# EAGLE design scentclock_1 (EAGLE 5.07)
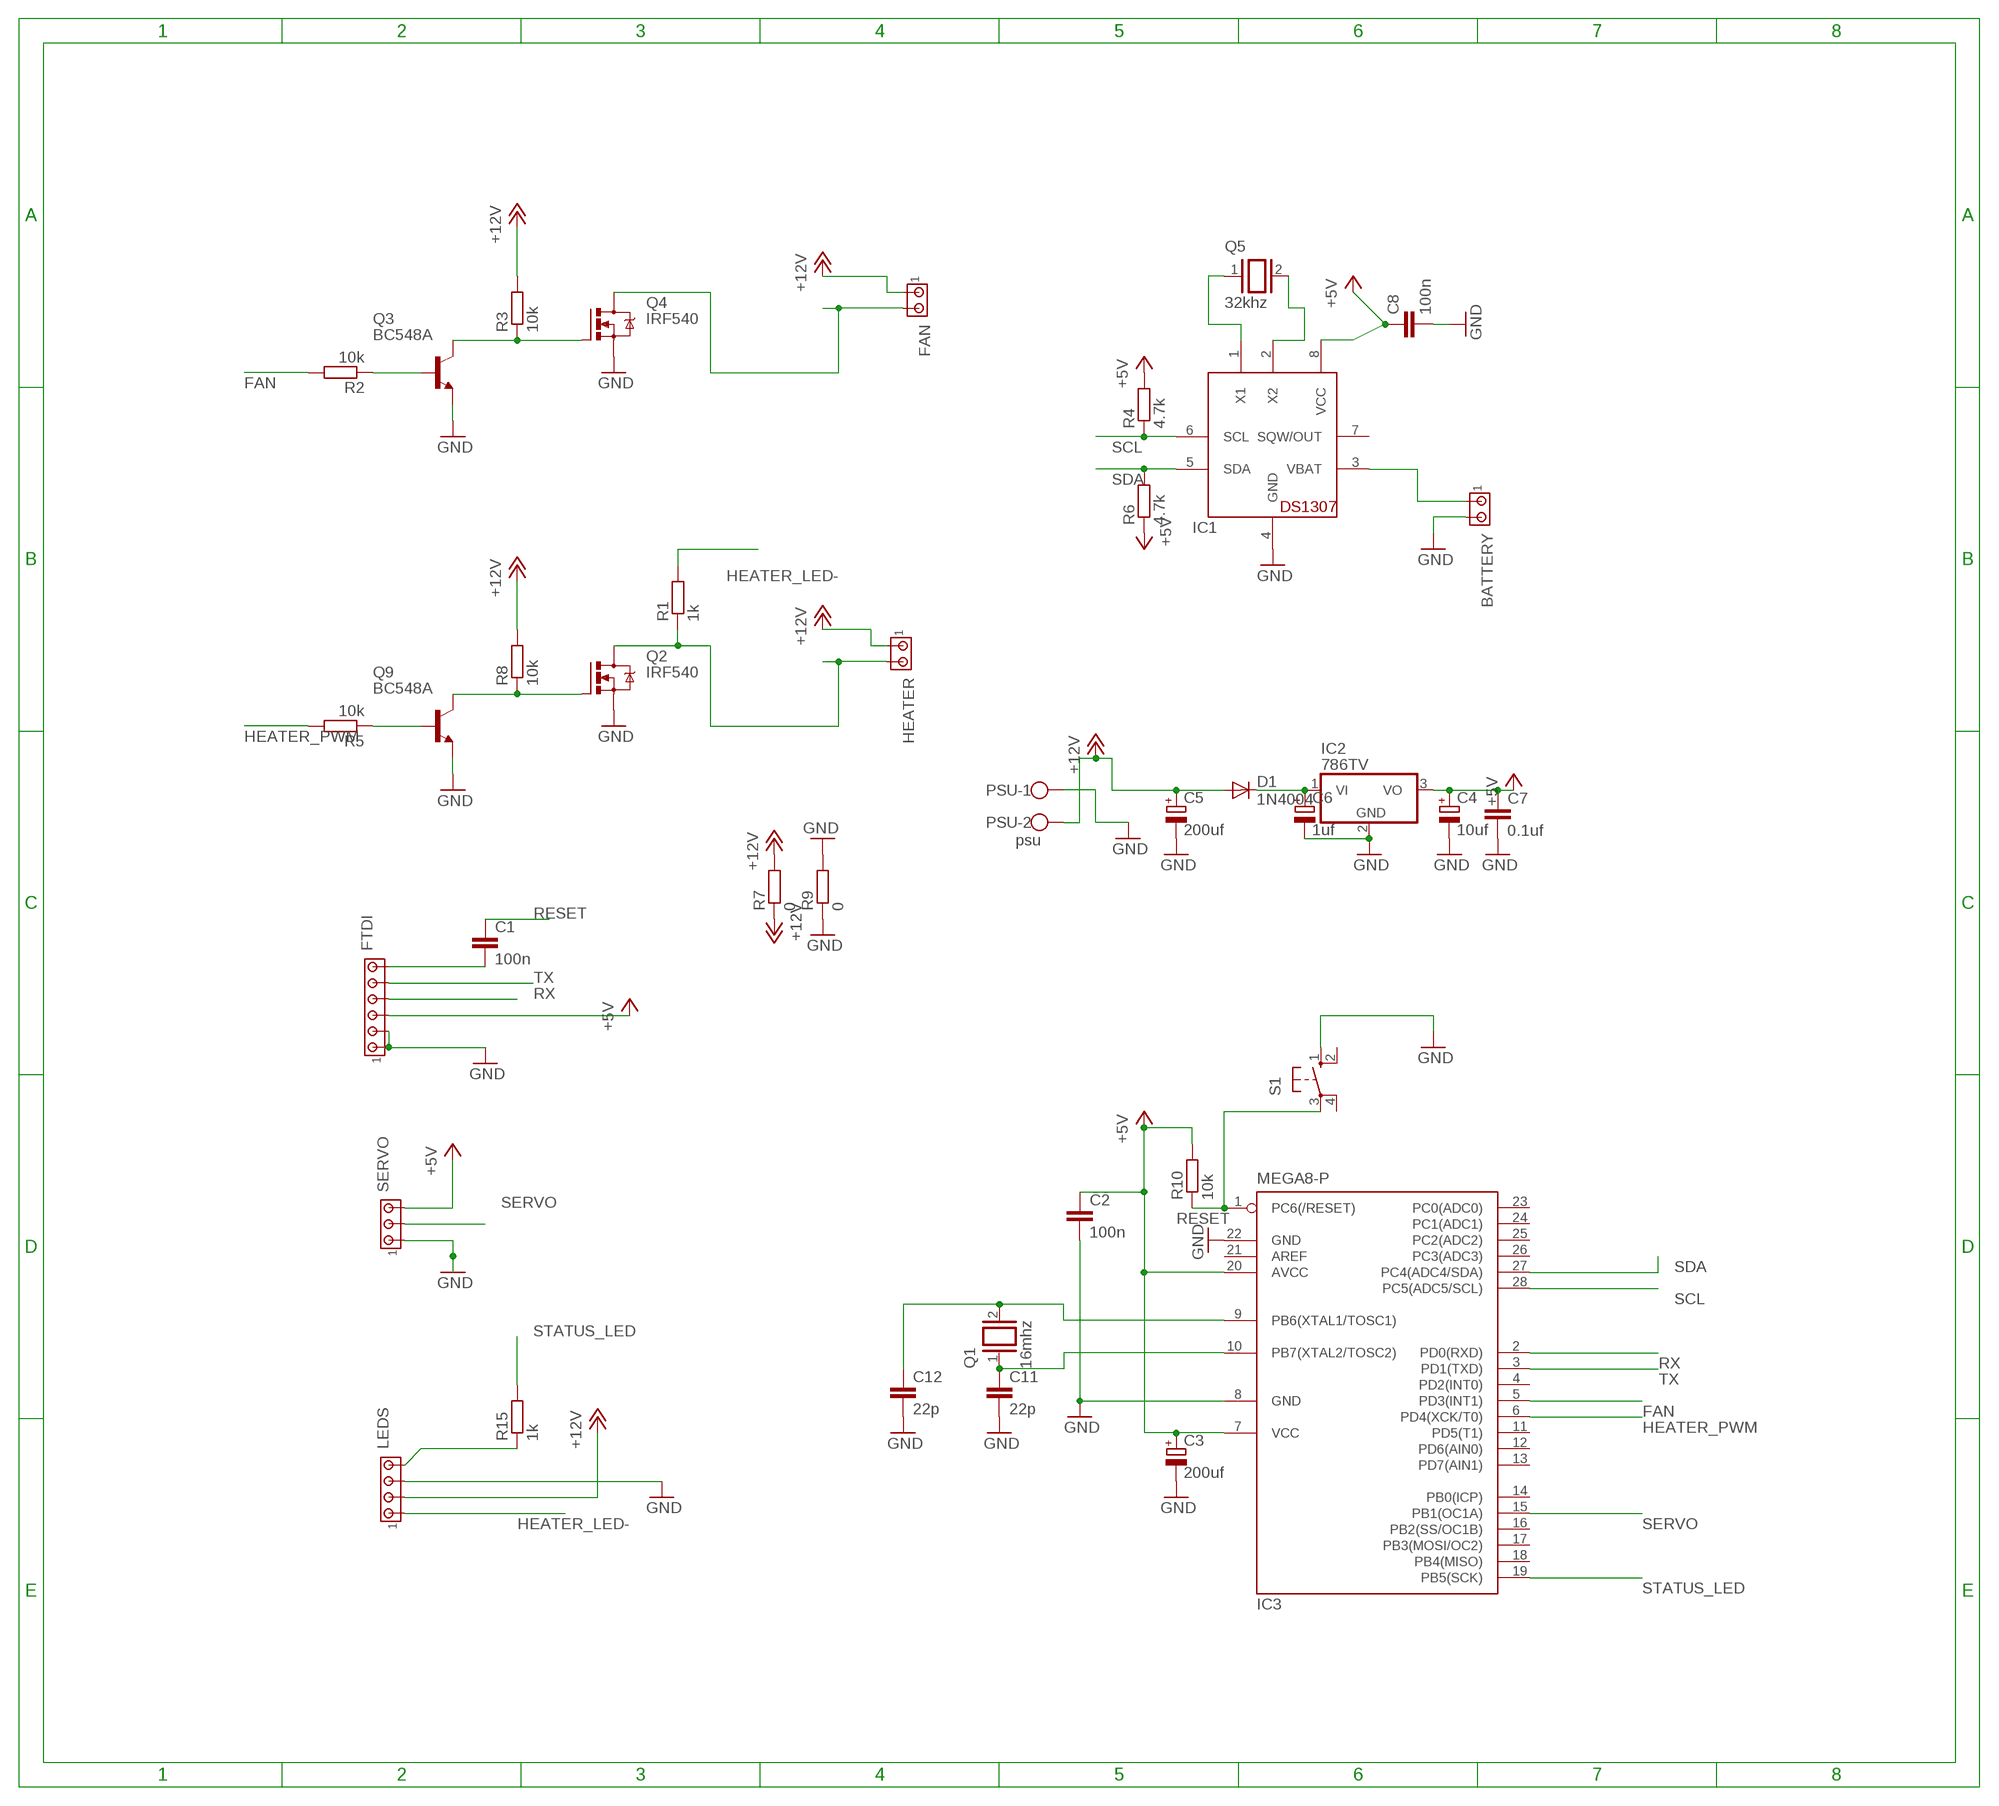
[diagram p0: schematic, sheet 1]

## Parts
BATTERY  MTA02-100  [10X02MTA]
C1  100n  C-EU050-025X075  [C050-025X075]
C2  100n  C-EU050-025X075  [C050-025X075]
C3  200uf  CPOL-EUE2-4  [E2-4]
C4  10uf  CPOL-EUE2-4  [E2-4]
C5  200uf  CPOL-EUE3.5-8  [E3,5-8]
C6  1uf  CPOL-EUE2-4  [E2-4]
C7  0.1uf  C-EU050-025X075  [C050-025X075]
C8  100n  C-EU050-025X075  [C050-025X075]
C11  22p  C-EU050-025X075  [C050-025X075]
C12  22p  C-EU050-025X075  [C050-025X075]
D1  1N4004  [DO41-10]
FAN  MTA02-100  [10X02MTA]
FTDI  MTA06-100  [10X06MTA]
HEATER  MTA02-100  [10X02MTA]
IC1  DS1307  [DIL08]
IC2  786TV  [TO220V]
IC3  MEGA8-P  [DIL28-3]
LEDS  MTA04-100  [10X04MTA]
PSU  psu  W237-102  [W237-102]
Q1  16mhz  XTAL/S  [QS]
Q2  IRF540  [TO220BV]
Q3  BC548A  [TO92-EBC]
Q4  IRF540  [TO220BV]
Q5  32khz  XTAL/S  [QS]
Q9  BC548A  [TO92-EBC]
R1  1k  R-EU_0204/7  [0204/7]
R2  10k  R-EU_0204/7  [0204/7]
R3  10k  R-EU_0204/7  [0204/7]
R4  4.7k  R-EU_0204/7  [0204/7]
R5  10k  R-EU_0204/7  [0204/7]
R6  4.7k  R-EU_0204/7  [0204/7]
R7  0  R-EU_0204/7  [0204/7]
R8  10k  R-EU_0204/7  [0204/7]
R9  0  R-EU_0204/7  [0204/7]
R10  10k  R-EU_0204/7  [0204/7]
R15  1k  R-EU_0204/7  [0204/7]
S1  10-XX  [B3F-10XX]
SERVO  MTA03-100  [10X03MTA]

## Nets
+5V: C2.1 C3.+ C4.+ C7.1 C8.1 FTDI.4 IC1.8(VCC) IC2.3(VO) IC3.7(VCC) IC3.20(AVCC) R4.2 R6.1 R10.2 SERVO.3
+12V [power]: C5.+ D1.A FAN.1 HEATER.1 LEDS.2 PSU.2 R3.2 R7.1 R7.2 R8.2
FAN: IC3.5(PD3(INT1)) R2.2
GND [power]: BATTERY.2 C2.2 C3.- C4.- C5.- C6.- C7.2 C8.2 C11.2 C12.2 FTDI.5 FTDI.6 IC1.4(GND) IC2.2(GND) IC3.8(GND) IC3.22(GND) LEDS.3 PSU.1 Q2.S Q3.E Q4.S Q9.E R9.1 R9.2 S1.1(S) SERVO.1
HEATER_LED-: LEDS.1 R1.2
HEATER_PWM: IC3.6(PD4(XCK/T0)) R5.2
N$1: Q3.C Q4.G R3.1
N$3: IC1.1(X1) Q5.1
N$4 [power]: HEATER.2 Q2.D R1.1
N$5: C1.2 FTDI.1
N$6: Q3.B R2.1
N$7: LEDS.4 R15.1
N$8 [power]: FAN.2 Q4.D
N$9: IC1.2(X2) Q5.2
N$10: C11.1 IC3.10(PB7(XTAL2/TOSC2)) Q1.1
N$11: C12.1 IC3.9(PB6(XTAL1/TOSC1)) Q1.2
N$12: BATTERY.1 IC1.3(VBAT)
N$17: Q2.G Q9.C R8.1
N$18: Q9.B R5.1
N$19: C6.+ D1.C IC2.1(VI)
RESET: C1.1 IC3.1(PC6(/RESET)) R10.1 S1.3(P)
RX: FTDI.3 IC3.2(PD0(RXD))
SCL: IC1.6(SCL) IC3.28(PC5(ADC5/SCL)) R4.1
SDA: IC1.5(SDA) IC3.27(PC4(ADC4/SDA)) R6.2
SERVO: IC3.15(PB1(OC1A)) SERVO.2
STATUS_LED: IC3.19(PB5(SCK)) R15.2
TX: FTDI.2 IC3.3(PD1(TXD))
Unconnected: IC1.7(SQW/OUT) IC3.4(PD2(INT0)) IC3.11(PD5(T1)) IC3.12(PD6(AIN0)) IC3.13(PD7(AIN1)) IC3.14(PB0(ICP)) IC3.16(PB2(SS/OC1B)) IC3.17(PB3(MOSI/OC2)) IC3.18(PB4(MISO)) IC3.21(AREF) IC3.23(PC0(ADC0)) IC3.24(PC1(ADC1)) IC3.25(PC2(ADC2)) IC3.26(PC3(ADC3)) S1.2(S1) S1.4(P1)

## Library data of the parts
BATTERY FAN HEATER = matt con-amp:MTA02-100: AMP connector
C1 C2 C7 C8 C11 C12 = matt rcl:C-EU: CAPACITOR, European symbol
C3-C6 = matt rcl:CPOL-EU: POLARIZED CAPACITOR, European symbol
D1 = matt diode:1N4004: DIODE general purpose rectifier, 1 A
FTDI = matt con-amp:MTA06-100: AMP connector
IC1 = adafruit:DS1307: DS1307 Real time clock (RTC) with battery backup ability. Talk to it via i2c
IC2 = linear:78*: Positive VOLTAGE REGULATOR Source: http://cache.national.com/ds/LM/LM78L05.pdf http://www.fairchildsemi.com/ds/LM/LM7805.pdf
IC3 = atmel:MEGA8-P: MICROCONTROLLER 8 Kbytes FLASH, 1 kbytes SRAM, 512 bytes EEPROM, USART, 4-channel 10 bit ADC, 2-channel 8 bit ADC Pin compatible with Atmega48, ATMega88, ATMega168 Source: avr.lbr
LEDS = matt con-amp:MTA04-100: AMP connector
PSU = matt con-wago-500:W237-102: WAGO SCREW CLAMP
Q1 Q5 = matt special:XTAL/S: CRYSTAL
Q2 Q4 = transistor-power:IRF540: HEXFET Power MOSFET
Q3 Q9 = matt transistor-npn:BC548*: NPN Transistor
R1-R10 R15 = matt rcl:R-EU_: RESISTOR, European symbol
S1 = switch-omron:10-XX: OMRON SWITCH
SERVO = matt con-amp:MTA03-100: AMP connector

## Net classes
1 power: width 2 mm

## Board
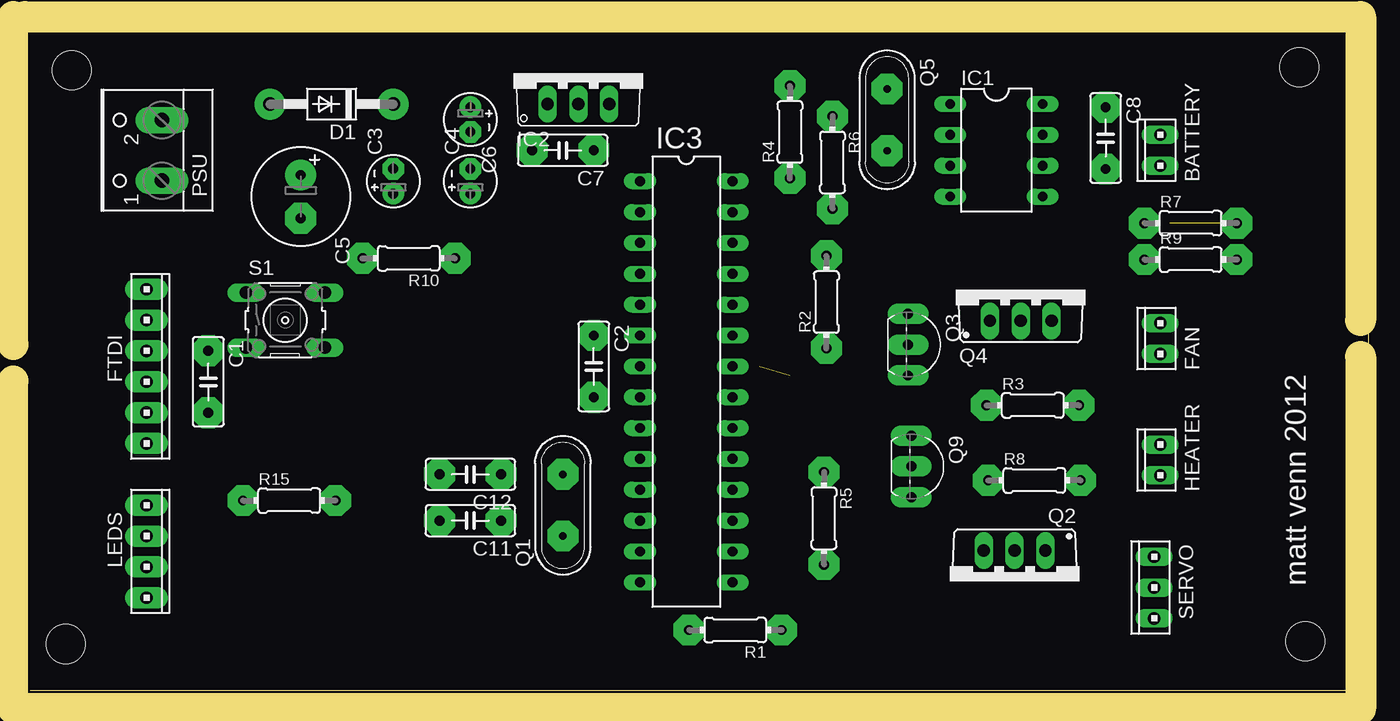
[diagram p1: board, top side]
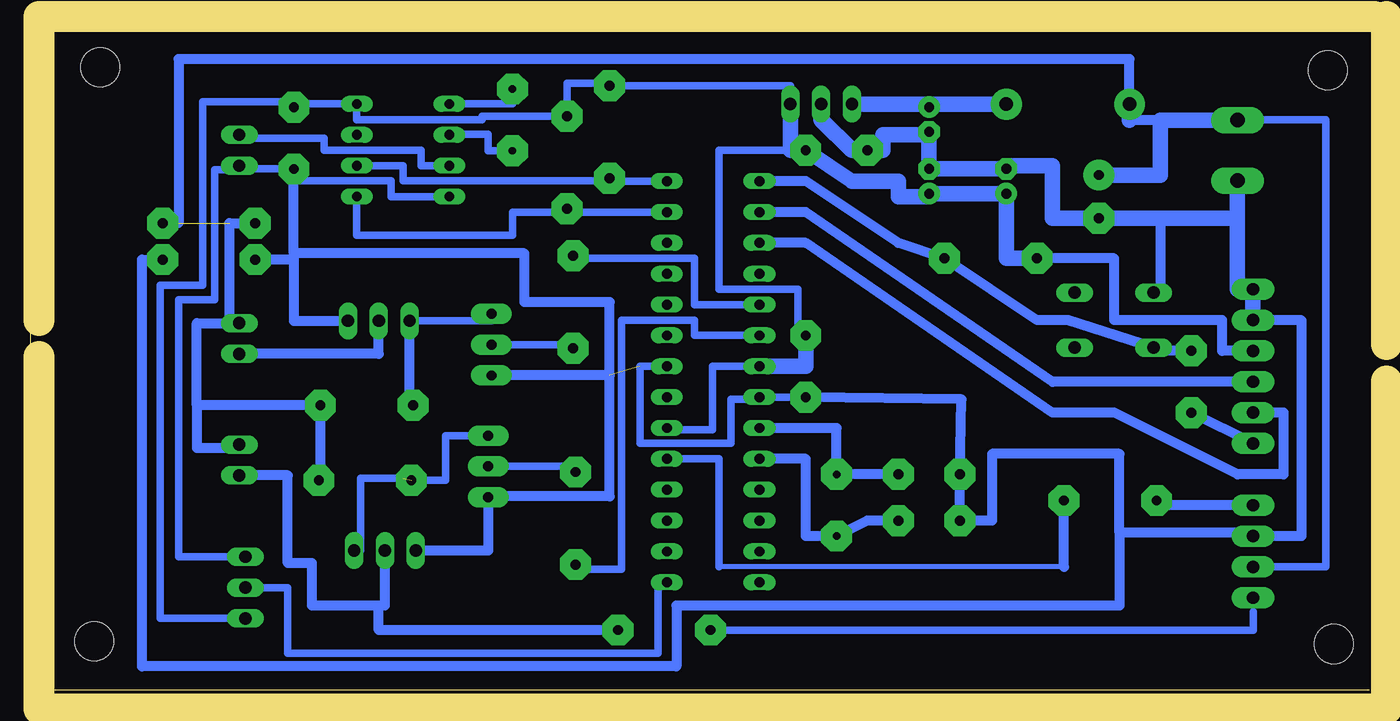
[diagram p2: board, bottom side, seen from below]

Size 110.26 x 54.33 mm. Coordinates in mm from the lower left corner, seen from the top.
Outline: 0,0 110.16,0 110.26,54.33 0.1,54.33
Copper layers (1*16): Top 0.035mm / dielectric 1.5mm / Bottom 0.035mm
Design rules "default": minimum track width 10mil, minimum drill 24mil, track to track 8mil, track to pad 8mil, pad to pad 8mil, via to via 8mil, smd to smd 8mil, copper to edge 40mil, drill to drill 8mil, minimum pad ring 10mil, minimum via ring 8mil, stop-mask expansion 4mil, vias tented up to drill 0mil, thermal gap 10mil
Holes 3.2 mm at 2.91,3.81 104.51,51.31 105.01,4.03 3.41,51.03
Milling: 6 lines

### Footprints (pad centres in the part's own frame; a part is rotated, then mirrored left to right if it is on the bottom)
10X02MTA = drill 1.016 long: 1 1.27,0; 2 -1.27,0
C050-025X075 = drill 0.813 pad 2.54 octagon: 1 -2.54,0; 2 2.54,0
E2-4 = drill 0.813 pad 1.778 round: + -1.016,0 | drill 0.813 pad 1.778 octagon: - 1.016,0
E3,5-8 = drill 0.813 pad 2.54 round: + -1.778,0 | drill 0.813 pad 2.54 octagon: - 1.778,0
DO41-10 = drill 1.118 pad 2.54 round: A 5.08,0; C -5.08,0
10X06MTA = drill 1.016 pad 1.778 long: 1 6.35,0; 2 3.81,0; 3 1.27,0; 4 -1.27,0; 5 -3.81,0; 6 -6.35,0
DIL08 = drill 0.813 long: 1 -3.81,-3.81; 2 -1.27,-3.81; 3 1.27,-3.81; 4 3.81,-3.81; 5 3.81,3.81; 6 1.27,3.81; 7 -1.27,3.81; 8 -3.81,3.81
TO220V = drill 1.016 long: 1 -2.54,-2.54; 2 0,-2.54; 3 2.54,-2.54
DIL28-3 = drill 0.813 long: 1 -16.51,-3.81; 2 -13.97,-3.81; 3 -11.43,-3.81; 4 -8.89,-3.81; 5 -6.35,-3.81; 6 -3.81,-3.81; 7 -1.27,-3.81; 8 1.27,-3.81; 9 3.81,-3.81; 10 6.35,-3.81; 11 8.89,-3.81; 12 11.43,-3.81; 13 13.97,-3.81; 14 16.51,-3.81; 15 16.51,3.81; 16 13.97,3.81; 17 11.43,3.81; 18 8.89,3.81; 19 6.35,3.81; 20 3.81,3.81; 21 1.27,3.81; 22 -1.27,3.81; 23 -3.81,3.81; 24 -6.35,3.81; 25 -8.89,3.81; 26 -11.43,3.81; 27 -13.97,3.81; 28 -16.51,3.81
10X04MTA = drill 1.016 pad 1.778 long: 1 3.81,0; 2 1.27,0; 3 -1.27,0; 4 -3.81,0
W237-102 = drill 1.194 pad 2.184 long: 1 -2.5,-1.27; 2 2.5,-1.27
QS = drill 0.61 pad 2.54 octagon: 1 -2.54,0; 2 2.54,0
TO220BV = drill 1.016 long: D 0,-2.54; G -2.54,-2.54; S 2.54,-2.54
TO92-EBC = drill 0.813 pad 1.676 long: B 0,-1.27; C -2.54,-1.27; E 2.54,-1.27
0204/7 = drill 0.813 pad 2.54 octagon: 1 -3.81,0; 2 3.81,0
B3F-10XX = drill 1.016 long: 1 -3.251,2.261; 2 3.251,2.261; 3 -3.251,-2.261; 4 3.251,-2.261
10X03MTA = drill 1.016 long: 1 2.54,0; 2 0,0; 3 -2.54,0

### Placement (x,y rotation side)
BATTERY  93.06,44.46 90 top
C1  14.65,25.4 270 top
C2  46.4,26.67 270 top
C3  29.89,41.91 90 top
C4  36.24,41.91 90 top
C5  22.27,40.64 270 top
C6  36.24,46.99 270 top
C7  43.86,44.45 180 top
C8  88.56,45.46 270 top
C11  36.24,13.97 180 top
C12  36.24,17.78 180 top
D1  24.81,48.26 180 top
FAN  93.06,28.96 90 top
FTDI  9.57,26.67 270 top
HEATER  93.06,18.96 90 top
IC1  79.56,44.46 270 top
IC2  45.13,50.8 0 top
IC3  54.02,25.4 270 top
LEDS  9.57,11.43 270 top
PSU  9.57,44.45 90 top
Q1  43.86,15.24 90 top
Q2  81.06,8.96 180 top
Q3  73.56,28.46 270 top
Q4  81.56,32.96 0 top
Q5  70.56,46.96 270 top
Q9  73.82,18.43 270 top
R1  58.06,4.96 180 top
R2  65.56,31.96 90 top
R3  82.56,23.46 0 top
R4  62.56,45.96 90 top
R5  65.36,14.16 270 top
R6  66.06,43.46 270 top
R7  95.56,38.46 0 top
R8  82.69,17.28 0 top
R9  95.56,35.46 0 top
R10  31.16,35.56 180 top
R15  21.32,15.62 0 top
S1  21,30.48 0 top
SERVO  92.56,8.46 90 top

### Tracks (layer width: path | path; a pad name or v marks a point on that pad's centre or on a via)
+5V
  Bottom 0.406: C4.+ 36.24,40.64 | R4.2 62.56,49.96 | 73.06,47.27 73.06,46.96 | 88.56,48.27 C8.1 88.56,48.46 | 47.06,29.21 C2.1 | C7.1 | IC2.3 47.67,49.77 | 58.56,21.46 57.83,21.46 IC3.20
  Bottom 0.61: 62.56,49.96 66.06,49.96 R6.1 73.06,47.27 | 73.06,46.96 83.37,46.96 IC1.8 88.56,48.27 | SERVO.3 99.56,5.92 99.56,33.36 96.06,33.36 96.06,48.46 88.56,48.46 | 47.06,29.21 47.06,33.02 53.56,33.02 53.56,44.46 C7.1 | 47.67,49.77 R4.2 | IC3.7 54.06,26.67 54.06,21.46 57.83,21.46
  Bottom 0.813: R10.2 21,35.56 21,30.48 12.11,30.48 12.11,27.94 FTDI.4
  Bottom 1.27: IC3.7 46.4,26.67 C2.1 | C4.+ C3.+ 29.89,35.56 R10.2 | IC2.3 47.67,44.45 C7.1 42.59,41.91 38.78,41.91 38.78,40.64 36.24,40.64
+12V  (1 unrouted)
  Bottom 0.406: 93.06,19.96 HEATER.1 | R8.2 86.37,17.28 | 11.56,46.96 11.56,46.95 | FAN.1 93.86,30.23
  Bottom 0.61: LEDS.2 3.56,10.16 3.56,46.96 11.56,46.96
  Bottom 0.813: FAN.1 96.56,30.23 96.56,23.46 | 96.56,23.46 96.56,19.96 93.06,19.96 | 86.37,17.28 R3.2 96.56,23.46 | 17.19,46.95 19.73,46.95 | R7.1 93.86,38.46 93.86,33.16 93.86,30.23 | R7.2 98.06,38.46 98.06,51.96 19.73,51.96 D1.A
  Bottom 1.27: PSU.2 11.56,46.95 17.19,46.95 17.19,42.42 C5.+ | 19.73,46.95 D1.A
FAN
  Bottom 0.406: 65.56,35.56 R2.2
  Bottom 0.61: IC3.5 55.56,31.75 55.56,35.56 65.56,35.56
GND  (1 unrouted)
  Bottom 0.406: 29.89,43.18 C3.- | C6.- 36.24,45.72 | 17.19,32.74 S1.1 | C8.2 88.56,41.96 | 93.06,42.86 BATTERY.2 93.06,42.92 | 88.56,35.96 88.56,35.46 | 72.55,15.96 Q9.E | 9.57,30.46 FTDI.5 | LEDS.3 9.57,12.96 | IC3.8 50.21,23.96
  Bottom 0.61: C2.2 IC3.8 | IC1.4 80.56,40.65 80.56,41.96 88.56,41.96 | SERVO.1 98.06,11 98.06,32.16 95.06,32.16 95.06,42.86 93.06,42.86 | C8.2 93.06,42.92 | IC3.22 60.06,26.67 60.06,20.32 52.56,20.32 52.56,23.96 50.21,23.96
  Bottom 0.813: C2.2 33.56,23.96 C12.2 C11.2 31.06,13.97 31.06,19.46 20.56,19.46 20.56,12.96 | 17.19,38.86 17.19,32.74 | Q4.S 88.56,30.42 88.56,35.46 R9.1 | C8.2 88.56,35.96 69.56,35.96 69.56,31.96 62.56,31.96 62.56,25.92 | 62.56,25.92 Q3.E | 62.56,25.92 62.56,15.96 72.55,15.96 | Q2.S 72.55,11.5 Q9.E | LEDS.3 5.56,12.7 5.56,30.46 9.57,30.46 | 9.57,12.96 20.56,12.96 | R9.2 101.06,35.46 101.06,1.96 57.06,1.96 57.06,6.96 20.56,6.96 20.56,12.96
  Bottom 1.27: FTDI.5 FTDI.6 10.84,33.02 10.84,38.86 | 10.84,38.86 17.19,38.86 C5.- 26.08,38.86 26.08,43.18 29.89,43.18 | 10.84,38.86 PSU.1 | C3.- C4.- C6.- | IC2.2 45.13,46.99 42.59,44.45 C7.2 40.05,44.45 40.05,45.72 36.24,45.72
HEATER_LED-
  Bottom 0.406: 9.56,6.46 9.57,6.96 LEDS.1
  Bottom 0.61: R1.2 9.56,4.96 9.56,6.46
HEATER_PWM
  Bottom 0.406: 65.36,9.96 R5.2
  Bottom 0.61: IC3.6 55.56,29.21 55.56,30.46 61.56,30.46 61.56,9.96 65.36,9.96
N$1
  Bottom 0.406: 72.29,30.42 Q3.C | R3.1 79.02,23.46
  Bottom 0.61: Q4.G 72.29,30.42
  Bottom 0.813: 79.02,23.46 Q4.G
N$3
  Bottom 0.406: Q5.1 70.56,48.27
  Bottom 0.61: 70.56,48.27 IC1.1
N$4
  Bottom 0.406: 81.56,6.96 81.06,6.96
  Bottom 0.813: HEATER.2 89.06,17.69 89.06,10.46 87.06,10.46 87.06,6.96 81.56,6.96 81.56,4.96 R1.1 | 81.06,6.96 Q2.D
N$5
  Bottom 0.813: FTDI.1 C1.2
N$6
  Bottom 0.406: R2.1 65.56,28.46
  Bottom 0.61: 65.56,28.46 Q3.B
N$7
  Bottom 0.406: 17.51,15.24 R15.1
  Bottom 0.813: LEDS.4 17.51,15.24
N$8
  Bottom 0.813: FAN.2 81.56,27.69 Q4.D
N$9
  Bottom 0.406: 75.75,45.76 IC1.2
  Bottom 0.61: Q5.2 72.56,44.42 72.56,45.76 75.75,45.76
N$10
  Bottom 0.813: IC3.10 46.4,19.05 46.4,12.7 Q1.1 41.32,13.97 C11.1
N$11
  Bottom 0.813: IC3.9 43.86,21.59 Q1.2 C12.1
N$12
  Bottom 0.406: 93.06,45.46 BATTERY.1
  Bottom 0.61: IC1.3 78.06,43.19 78.06,44.46 86.06,44.46 86.06,45.46 93.06,45.46
N$17  (1 unrouted)
  Bottom 0.406: Q2.G 83.06,11.5 | Q9.C
  Bottom 0.61: 83.06,11.5 83.06,17.46 79.56,17.46 | R8.1 76.06,17.28 76.06,20.96 Q9.C
N$18
  Bottom 0.406: R5.1 65.36,18.43
  Bottom 0.61: 65.36,18.43 Q9.B
N$19
  Bottom 0.406: 36.24,48.26 C6.+
  Bottom 1.27: D1.C 36.24,48.26 IC2.1
RESET
  Bottom 0.406: 17.75,27.94 S1.3
  Bottom 0.813: C1.1 17.75,27.94 | S1.3 24.81,30.48 27.35,30.48 R10.1 38.78,36.83 46.4,41.91 IC3.1
RX
  Bottom 0.813: IC3.2 46.4,39.37 26.08,25.4 FTDI.3
SCL
  Bottom 0.406: 62.56,41.91 R4.1 62.56,41.96
  Bottom 0.61: IC3.28 62.56,41.91 | IC1.6 79.56,43.19 79.56,41.96 62.56,41.96
SDA
  Bottom 0.406: IC3.27 66.06,39.37 R6.2
  Bottom 0.61: IC3.27 70.56,39.37 70.56,37.46 83.37,37.46 IC1.5
SERVO
  Bottom 0.406: 58.56,8.89 IC3.15
  Bottom 0.61: 58.56,8.89 58.56,3.06 89.06,3.06 89.06,8.46 SERVO.2
STATUS_LED
  Bottom 0.406: 25.13,10.16 53.56,10.16
  Bottom 0.61: IC3.19 53.56,19.05 53.56,10.16
  Bottom 0.813: 25.13,10.16 R15.2
TX
  Bottom 0.813: IC3.3 46.4,36.83 26.08,22.86 21,22.86 10.84,17.78 7.03,17.78 7.03,22.86 FTDI.2

### Text on the board
tPlace: matt venn 2012